# EAGLE design ConverterBoard (EAGLE 8.3.2)
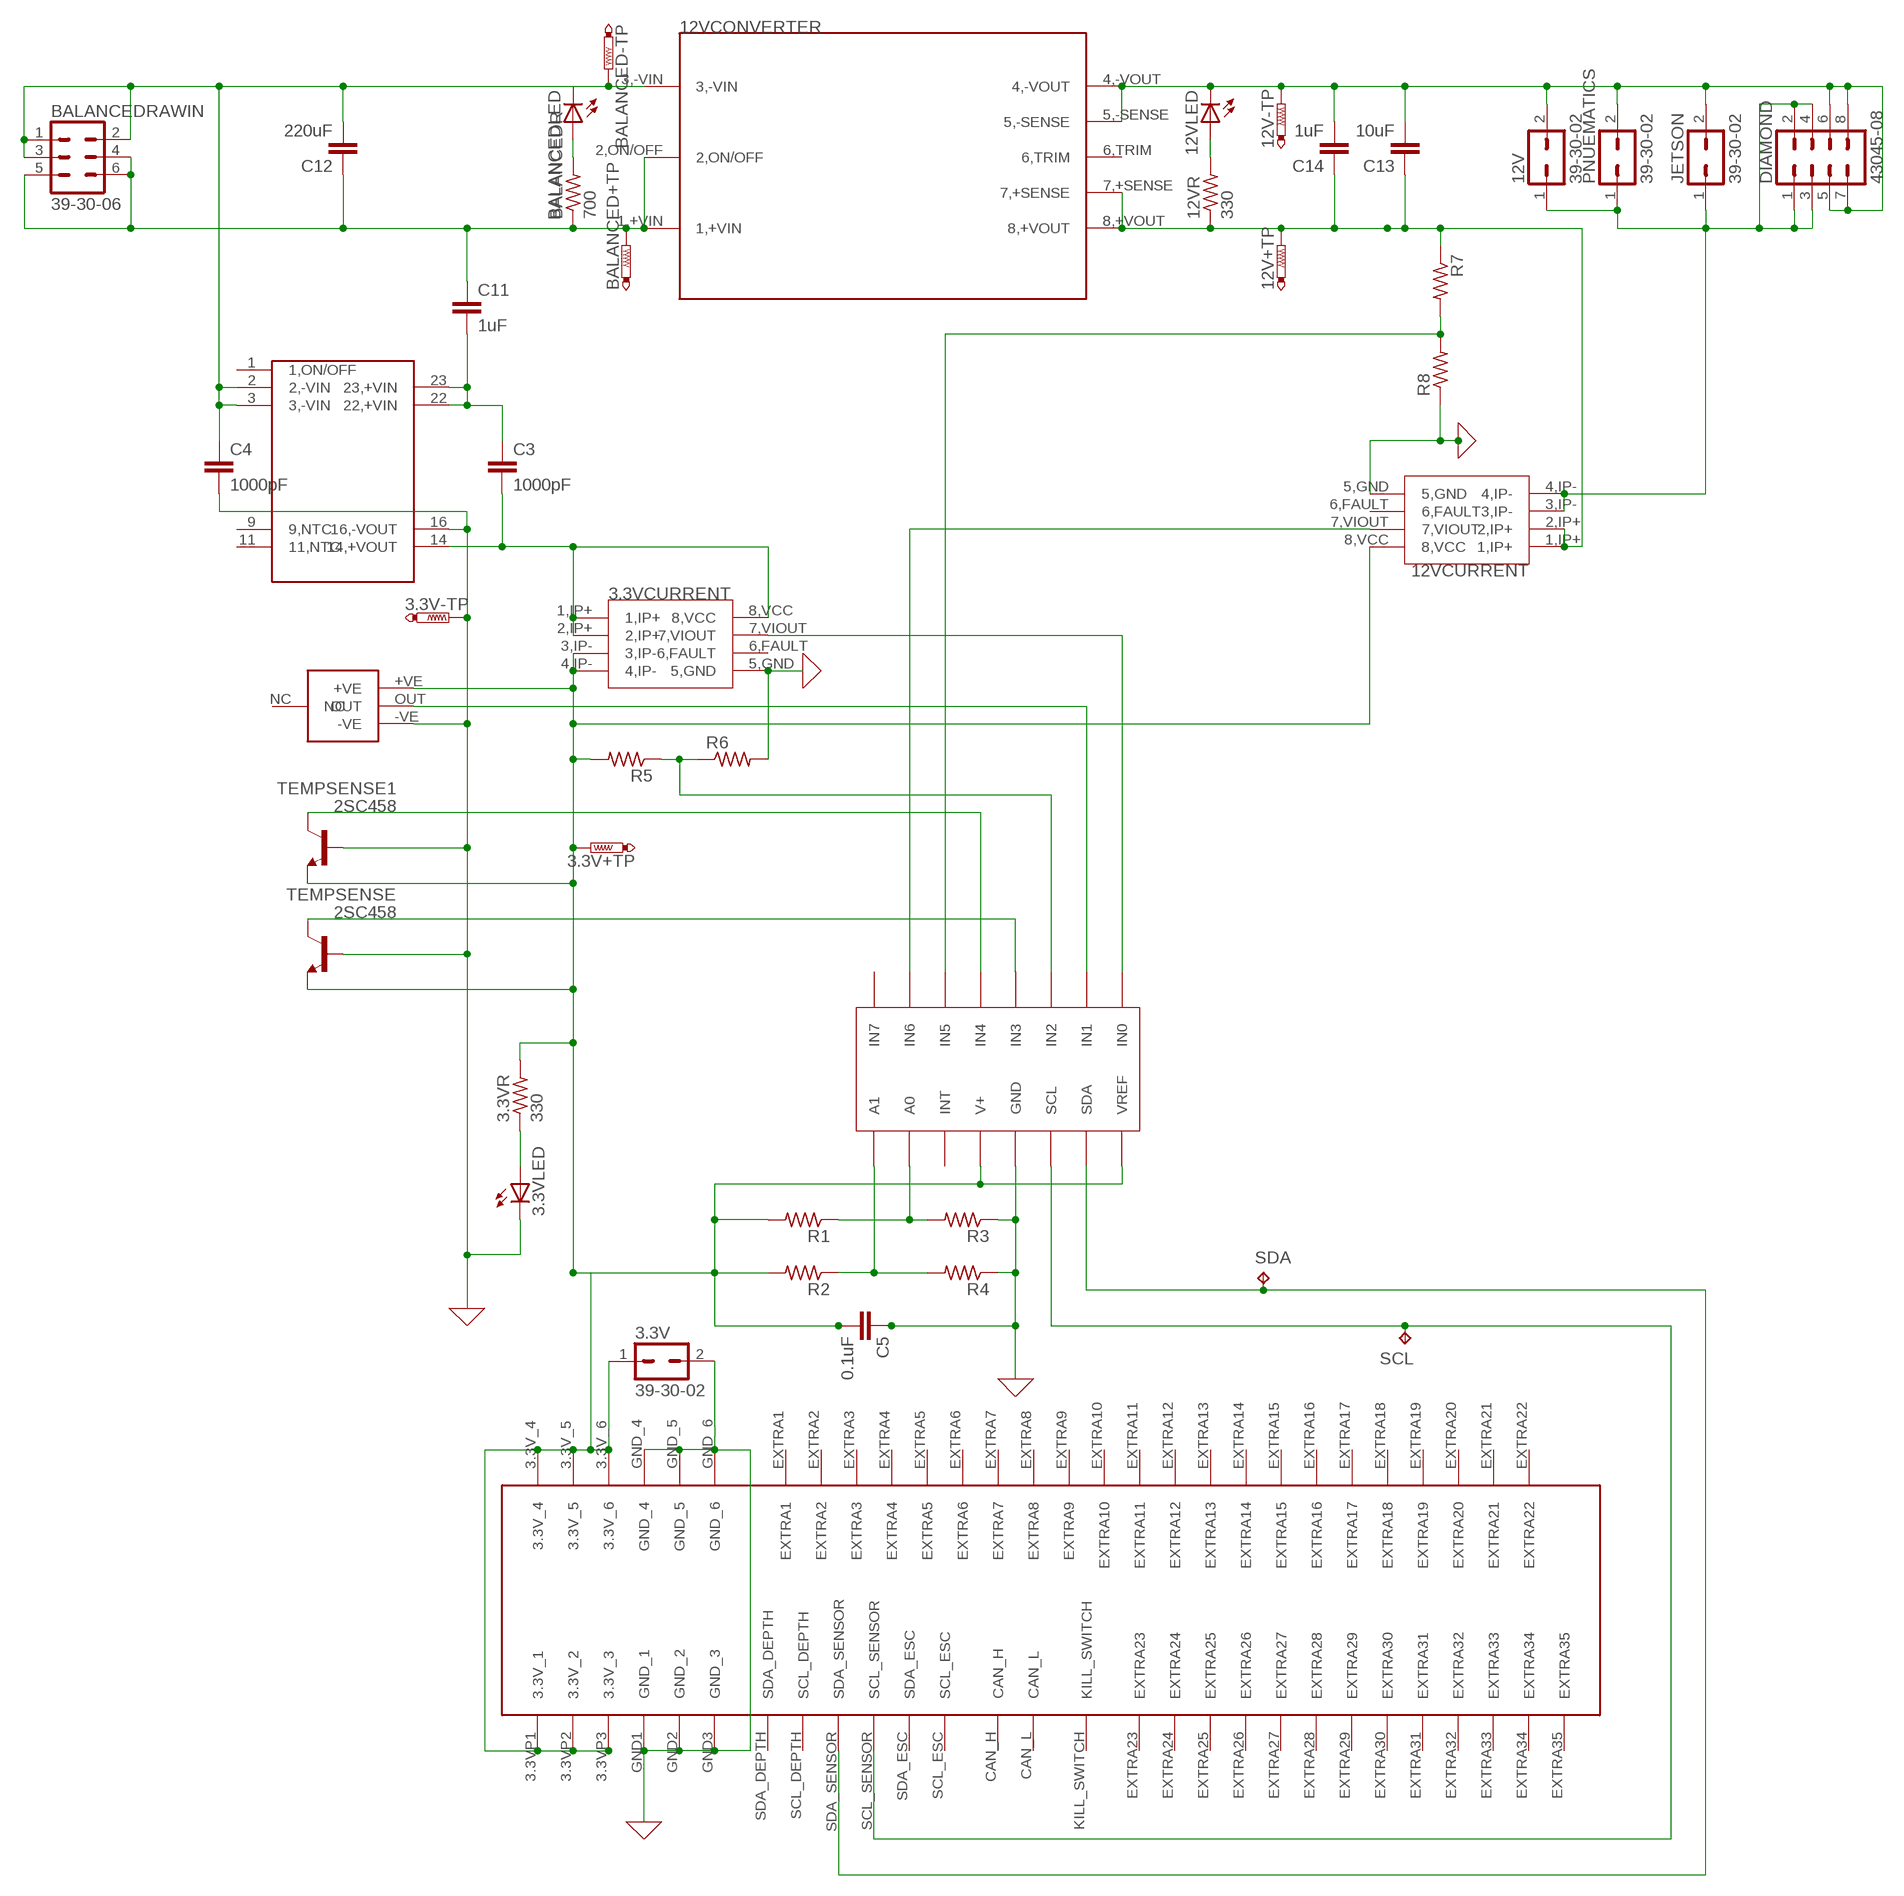
[diagram p0: schematic, sheet 1]

## Parts
3.3V  39-30-02  [39-30-?02?]
3.3V+TP  PTR1B1,27  [B1,27]
3.3V-TP  PTR1B1,27  [B1,27]
3.3VCURRENT  CURRENTSENS  [CURRENTSENS]
3.3VLED  LTST-S270GKT  [LTST-S270GKT]
3.3VR  330  R-US_0204/7  [0204/7]
12V  39-30-02  [39-30-?02?]
12V+TP  PTR1B1,27  [B1,27]
12V-TP  PTR1B1,27  [B1,27]
12VCONVERTER  12VCONV  [12VCONV]
12VCURRENT  CURRENTSENS  [CURRENTSENS]
12VLED  LTST-S270GKT  [LTST-S270GKT]
12VR  330  R-US_0204/7  [0204/7]
ADC  ADC128D818  [TSSOP-16]
BALANCED+TP  PTR1B1,27  [B1,27]
BALANCED-TP  PTR1B1,27  [B1,27]
BALANCEDLED  LTST-S270GKT  [LTST-S270GKT]
BALANCEDR  700  R-US_0204/7  [0204/7]
BALANCEDRAWIN  39-30-06  [39-30-?06?]
C3  1000pF  C5/3  [C5B3]
C4  1000pF  C5/3  [C5B3]
C5  0.1uF  C2.5/2  [C2.5-2]
C11  1uF  C5/3  [C5B3]
C12  220uF  C5/3  [C5B3]
C13  10uF  C5/3  [C5B3]
C14  1uF  C5/3  [C5B3]
DIAMOND  43045-08  [43045-08]
JETSON  39-30-02  [39-30-?02?]
PNUEMATICS  39-30-02  [39-30-?02?]
R1  R-US_0204/7  [0204/7]
R2  R-US_0204/7  [0204/7]
R3  R-US_0204/7  [0204/7]
R4  R-US_0204/7  [0204/7]
R5  R-US_0204/7  [0204/7]
R6  R-US_0204/7  [0204/7]
R7  R-US_0204/7  [0204/7]
R8  R-US_0204/7  [0204/7]
SCL  TPPAD1-20  [P1-20]
SDA  TPPAD1-20  [P1-20]
TEMPSENSE  2SC458  [TO92-ECB]
TEMPSENSE1  2SC458  [TO92-ECB]
U$2  3.3VCONV  [3.3VCONV]
U$3  5530843  [5530843-6-BOARDFINGERS]
U$6  HUMIDITYSENSOR  [HUMIDITYSENSOR]

## Nets
3.3VCONVIN: C3.1 C11.2 U$2.22(22,+VIN) U$2.23(23,+VIN)
3.3VCONVOUT: 3.3VCURRENT.1,IP+ 3.3VCURRENT.2,IP+ 3.3VCURRENT.8,VCC C3.2 U$2.14(14,+VOUT)
3.3VCURRENTDATA: 3.3VCURRENT.7,VIOUT ADC.IN0
3.3VCURRENTOUT: 3.3V+TP.TP 3.3V.1 3.3VCURRENT.3,IP- 3.3VCURRENT.4,IP- 3.3VR.2 12VCURRENT.8,VCC ADC.V+ ADC.VREF C5.2 R1.2 R2.2 R5.2 TEMPSENSE1.E TEMPSENSE.E U$3.3.3V_4 U$3.3.3V_5 U$3.3.3V_6 U$3.3.3VP1(3.3V_1) U$3.3.3VP2(3.3V_2) U$3.3.3VP3(3.3V_3) U$6.+VE
3.3VDATA: ADC.IN2 R5.1 R6.1
3.3VLED: 3.3VLED.ANODE(A) 3.3VR.1
12VCONV+: 12V+TP.TP 12VCONVERTER.7,+SENSE 12VCONVERTER.8,+VOUT 12VCURRENT.1,IP+ 12VCURRENT.2,IP+ 12VR.1 C13.1 C14.1 R7.1
12VCURRENTDATA: 12VCURRENT.7,VIOUT ADC.IN6
12VCURRENTOUT: 12V.1 12VCURRENT.3,IP- 12VCURRENT.4,IP- DIAMOND.1 DIAMOND.2 DIAMOND.3 DIAMOND.4 JETSON.1 PNUEMATICS.1
12VDIV: ADC.IN5 R7.2 R8.2
12VLED: 12VLED.ANODE(A) 12VR.2
A0: ADC.A0 R1.1 R3.2
A1: ADC.A1 R2.1 R4.2
BALANCED+: 12VCONVERTER.1,+VIN 12VCONVERTER.2,ON/OFF BALANCED+TP.TP BALANCEDR.1 BALANCEDRAWIN.4 BALANCEDRAWIN.5 BALANCEDRAWIN.6 C11.1 C12.1
BALANCEDGND: 12VCONVERTER.3,-VIN BALANCED-TP.TP BALANCEDLED.CATHODE(C) BALANCEDRAWIN.1 BALANCEDRAWIN.2 BALANCEDRAWIN.3 C4.1 C12.2 U$2.2(2,-VIN) U$2.3(3,-VIN)
BALANCEDLED: BALANCEDLED.ANODE(A) BALANCEDR.2
CMGND: 3.3V-TP.TP 3.3V.2 3.3VCURRENT.5,GND 3.3VLED.CATHODE(C) 12V-TP.TP 12V.2 12VCONVERTER.4,-VOUT 12VCONVERTER.5,-SENSE 12VCURRENT.5,GND 12VLED.CATHODE(C) ADC.GND C4.2 C5.1 C13.2 C14.2 DIAMOND.5 DIAMOND.6 DIAMOND.7 DIAMOND.8 JETSON.2 PNUEMATICS.2 R3.1 R4.1 R6.2 R8.1 TEMPSENSE1.B TEMPSENSE.B U$2.16(16,-VOUT) U$3.GND1(GND_1) U$3.GND2(GND_2) U$3.GND3(GND_3) U$3.GND_4 U$3.GND_5 U$3.GND_6 U$6.-VE ; supply symbol labelled GND
HUMIDITYDATA: ADC.IN1 U$6.OUT
SCL: ADC.SCL SCL.TP U$3.SCL_SENSOR
SDA: ADC.SDA SDA.TP U$3.SDA_SENSOR
TEMP1DATA: ADC.IN4 TEMPSENSE1.C
TEMPDATA: ADC.IN3 TEMPSENSE.C
Unconnected: 3.3VCURRENT.6,FAULT 12VCONVERTER.6,TRIM 12VCURRENT.6,FAULT ADC.IN7 ADC.INT U$2.1(1,ON/OFF) U$2.9(9,NTC) U$2.11(11,NTC) U$3.CAN_H U$3.CAN_L U$3.EXTRA1 U$3.EXTRA2 U$3.EXTRA3 U$3.EXTRA4 U$3.EXTRA5 U$3.EXTRA6 U$3.EXTRA7 U$3.EXTRA8 U$3.EXTRA9 U$3.EXTRA10 U$3.EXTRA11 U$3.EXTRA12 U$3.EXTRA13 U$3.EXTRA14 U$3.EXTRA15 U$3.EXTRA16 U$3.EXTRA17 U$3.EXTRA18 U$3.EXTRA19 U$3.EXTRA20 U$3.EXTRA21 U$3.EXTRA22 U$3.EXTRA23 U$3.EXTRA24 U$3.EXTRA25 U$3.EXTRA26 U$3.EXTRA27 U$3.EXTRA28 U$3.EXTRA29 U$3.EXTRA30 U$3.EXTRA31 U$3.EXTRA32 U$3.EXTRA33 U$3.EXTRA34 U$3.EXTRA35 U$3.KILL_SWITCH U$3.SCL_DEPTH U$3.SCL_ESC U$3.SDA_DEPTH U$3.SDA_ESC U$6.NC

## Library data of the parts
3.3V 12V JETSON PNUEMATICS = con-molex-mini-fit:39-30-?02?: HEADER
3.3V+TP 3.3V-TP 12V+TP 12V-TP BALANCED+TP BALANCED-TP = testpad:PTR1: TEST PIN
3.3VCURRENT 12VCURRENT = CurrentSensor:CURRENTSENS
3.3VLED 12VLED BALANCEDLED = LTST-S270GKT:LTST-S270GKT
3.3VR 12VR BALANCEDR R1-R8 = resistor:R-US_: RESISTOR, American symbol
12VCONVERTER = 12VCONV:12VCONV
ADC = ADC128D818:ADC128D818
BALANCEDRAWIN = con-molex-mini-fit:39-30-?06?: HEADER
C3-C5 C11-C14 = capacitor-wima:C: CAPACITOR naming: grid - package width
DIAMOND = con-molex-micro-fit:43045-08: HEADER
SCL SDA = testpad:TP: Test pad
TEMPSENSE TEMPSENSE1 = transistor:2SC458: NPN Silicon Epitaxial Planar Transistor Source: SEMTECH ELECTRONICS LTD. ... 2SC458 1.pdf
U$2 = 3.3V Converter:3.3VCONV
U$3 = 5530843-6:5530843
U$6 = HumiditySensor:HUMIDITYSENSOR

## Board
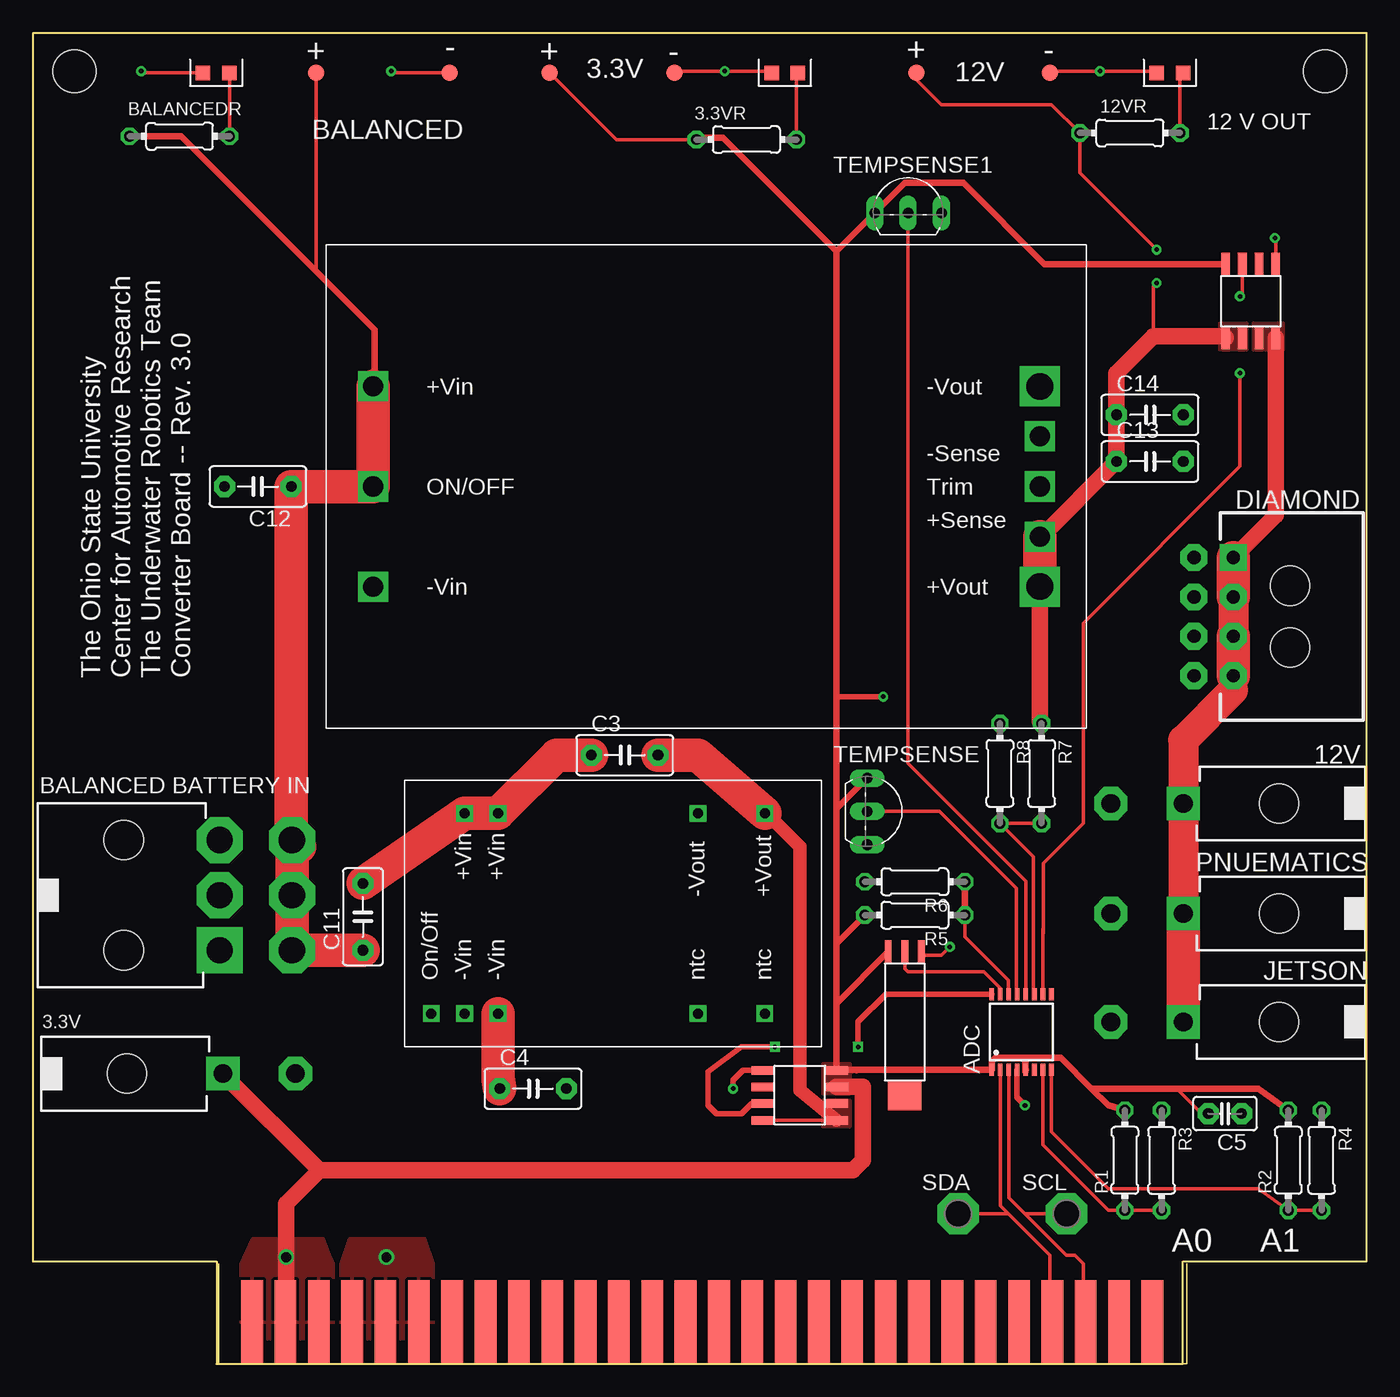
[diagram p1: board, top side]
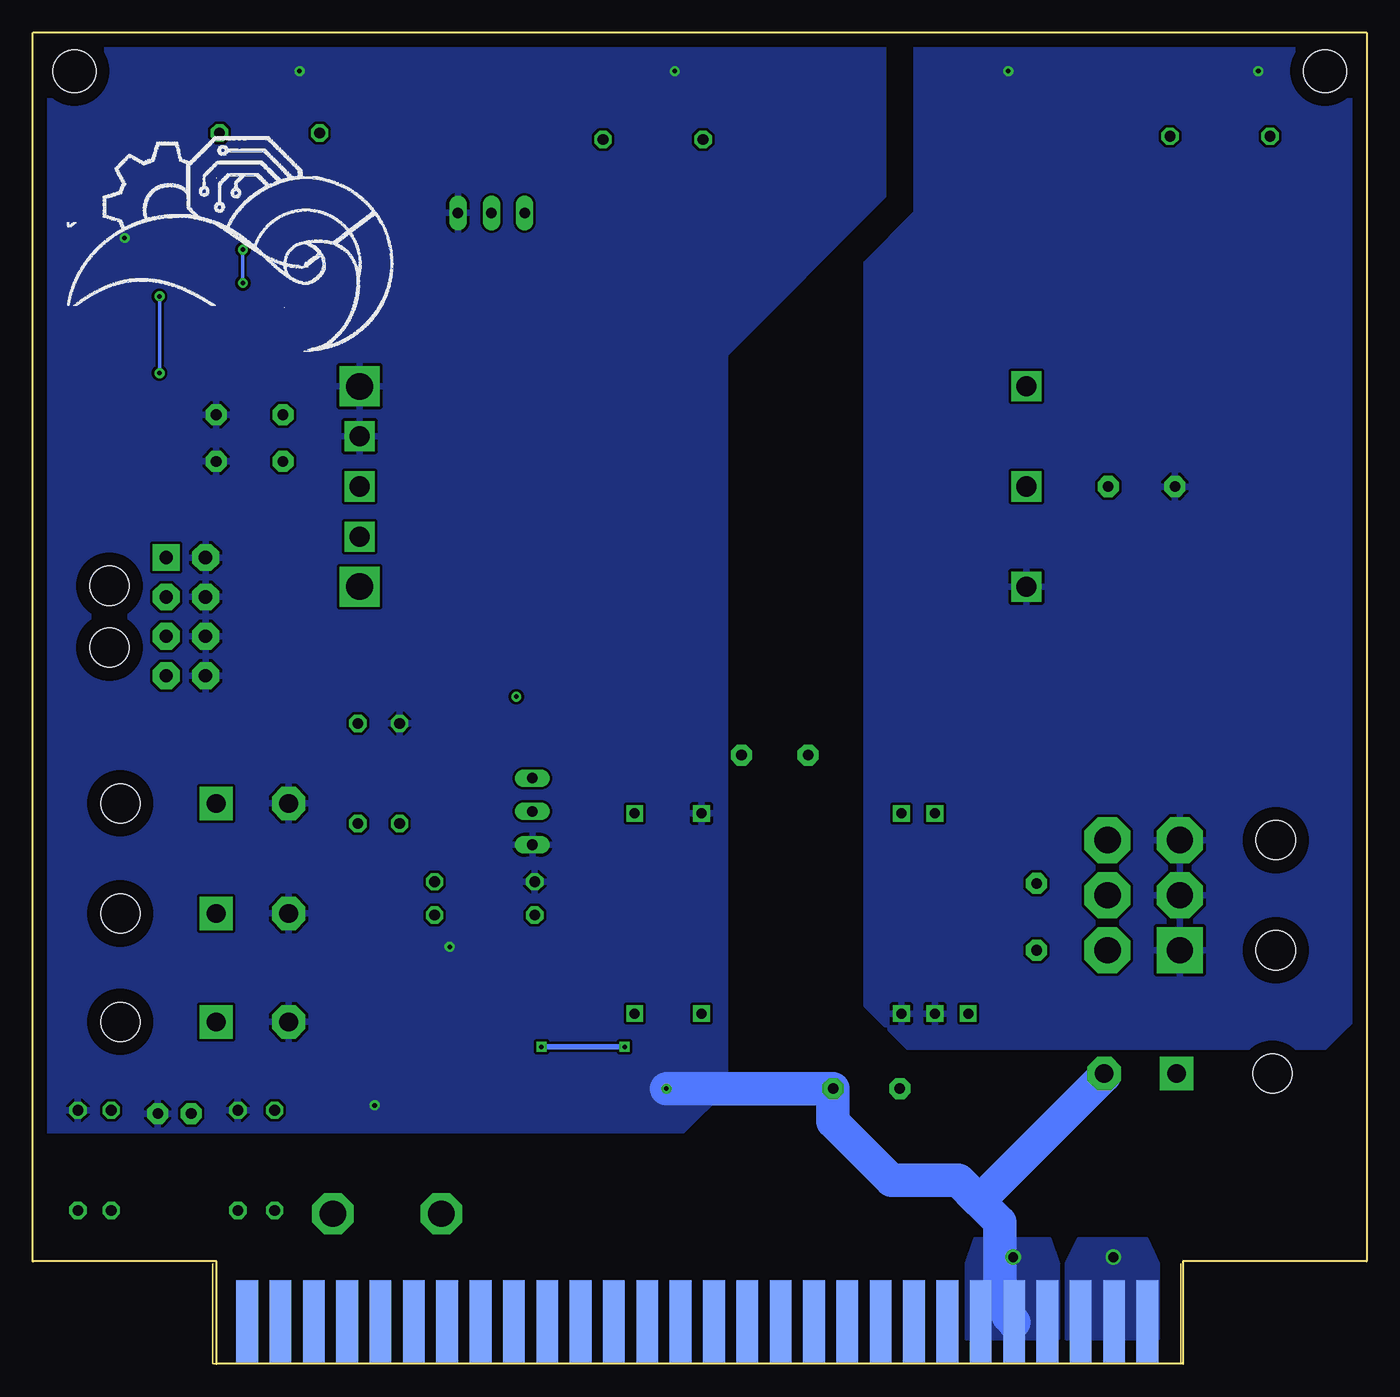
[diagram p2: board, bottom side, seen from below]

Size 101.6 x 101.35 mm. Coordinates in mm from the lower left corner, seen from the top.
Outline: 14,0 87.6,0 87.6,7.8 101.6,7.8 101.6,101.35 0,101.35 0,7.8 14,7.8 14,0
Copper layers (1*16): Top 0.035mm / dielectric 1.5mm / Bottom 0.035mm
Design rules "battery_balancer": minimum track width 6mil, minimum drill 0.35mm, track to track 0.205mm, track to pad 0.205mm, pad to pad 0.205mm, via to via 0.205mm, smd to smd 6mil, copper to edge 40mil, drill to drill 6mil, minimum pad ring 10mil, minimum via ring 8mil, stop-mask expansion 4mil, vias tented up to drill 0mil, thermal gap 10mil
Holes 3.26 mm at 3.17,98.42 98.42,98.42

### Footprints (pad centres in the part's own frame; a part is rotated, then mirrored left to right if it is on the bottom)
39-30-?02? = drill 1.422 pad 2.54 square: 1 0,0 | drill 1.422 pad 2.54 octagon: 2 0,5.512 | hole 3: 0,-7.3
B1,27 = smd 1.27 x 1.27: TP 0,0
CURRENTSENS = smd 0.65 x 1.75: 1,IP+ 0,0; 2,IP+ 1.27,0; 3,IP- 2.54,0; 4,IP- 3.81,0; 5,GND 3.81,5.6; 6,FAULT 2.54,5.6; 7,VIOUT 1.27,5.6; 8,VCC 0,5.6
LTST-S270GKT = smd 1.1 x 1.1: ANODE 1,0; CATHODE -1,0
0204/7 = drill 0.813 octagon: 1 -3.81,0; 2 3.81,0
12VCONV = drill 1.524 square: 1,+VIN 3.556,26.035; 2,ON/OFF 3.556,18.415; 3,-VIN 3.556,10.795; 5,-SENSE 54.356,22.225; 6,TRIM 54.356,18.415; 7,+SENSE 54.356,14.605 | drill 2.032 square: 4,-VOUT 54.356,26.035; 8,+VOUT 54.356,10.795
TSSOP-16 = smd 0.9 x 0.35: A0 -2.875,-1.625; A1 -2.875,-2.275; GND -2.875,0.325; IN0 2.875,2.275; IN1 2.875,1.625; IN2 2.875,0.975; IN3 2.875,0.325; IN4 2.875,-0.325; IN5 2.875,-0.975; IN6 2.875,-1.625; IN7 2.875,-2.275; INT -2.875,-0.975; SCL -2.875,0.975; SDA -2.875,1.625; V+ -2.875,-0.325; VREF -2.875,2.275
39-30-?06? = drill 2 pad 3.5 square: 1 4.191,0 | drill 2 pad 3.5 octagon: 2 0,0; 3 -4.191,0; 4 4.191,5.512; 5 0,5.512; 6 -4.191,5.512 | hole 3: -4.191,-7.3; 4.191,-7.3
C5B3 = drill 0.813 pad 1.6 octagon: 1 -2.54,0; 2 2.54,0
C2.5-2 = drill 0.813 pad 1.6 octagon: 1 -1.27,0; 2 1.27,0
43045-08 = drill 1.016 pad 2.032 square: 1 4.5,0 | drill 1.016 pad 2.032 octagon: 2 1.5,0; 3 -1.5,0; 4 -4.5,0; 5 4.5,3; 6 1.5,3; 7 -1.5,3; 8 -4.5,3 | hole 3: -2.35,-4.32; 2.35,-4.32
P1-20 = drill 2.007 pad 3.15 octagon: TP 0,0
TO92-ECB = drill 0.813 long: B 2.54,0; C 0,0; E -2.54,0
3.3VCONV = drill 0.762 square: 1 2.54,29.718; 2 2.54,27.178; 3 2.54,24.638; 9 2.54,9.398; 11 2.54,4.318; 14 17.78,4.318; 16 17.78,9.398; 22 17.78,24.638; 23 17.78,27.178
5530843-6-BOARDFINGERS = smd 1.651 x 6.35 bottom: 3.3V_4 0.826,3.175; 3.3V_5 3.365,3.175; 3.3V_6 5.905,3.175; EXTRA1 16.066,3.175; EXTRA2 18.605,3.175; EXTRA3 21.145,3.175; EXTRA4 23.686,3.175; EXTRA5 26.226,3.175; EXTRA6 28.765,3.175; EXTRA7 31.305,3.175; EXTRA8 33.846,3.175; EXTRA9 36.386,3.175; EXTRA10 38.925,3.175; EXTRA11 41.465,3.175; EXTRA12 44.005,3.175; EXTRA13 46.545,3.175; EXTRA14 49.086,3.175; EXTRA15 51.626,3.175; EXTRA16 54.166,3.175; EXTRA17 56.706,3.175; EXTRA18 59.245,3.175; EXTRA19 61.785,3.175; EXTRA20 64.326,3.175; EXTRA21 66.865,3.175; EXTRA22 69.406,3.175; GND_4 8.445,3.175; GND_5 10.986,3.175; GND_6 13.525,3.175 | smd 1.651 x 6.35: 3.3VP1 0.826,3.175; 3.3VP2 3.365,3.175; 3.3VP3 5.905,3.175; CAN_H 51.626,3.175; CAN_L 54.166,3.175; EXTRA23 16.066,3.175; EXTRA24 18.605,3.175; EXTRA25 21.145,3.175; EXTRA26 23.686,3.175; EXTRA27 26.226,3.175; EXTRA28 28.765,3.175; EXTRA29 31.305,3.175; EXTRA30 33.846,3.175; EXTRA31 36.386,3.175; EXTRA32 38.925,3.175; EXTRA33 41.465,3.175; EXTRA34 44.005,3.175; EXTRA35 46.545,3.175; GND1 8.445,3.175; GND2 10.986,3.175; GND3 13.525,3.175; KILL_SWITCH 49.086,3.175; SCL_DEPTH 59.245,3.175; SCL_ESC 69.406,3.175; SCL_SENSOR 64.326,3.175; SDA_DEPTH 56.706,3.175; SDA_ESC 66.865,3.175; SDA_SENSOR 61.785,3.175
HUMIDITYSENSOR = smd 0.51 x 1.78: +VE 2.54,0; -VE 0,0; OUT 1.27,0 | smd 2.54 x 2.29: NC 1.27,10.925

### Placement (x,y rotation side)
3.3V  39-30-02?  [39-30-?02?]  14.48,22.1 270 top
3.3V+TP  39.37,98.3 0 top
3.3V-TP  48.9,98.3 0 top
3.3VCURRENT  61.21,18.54 90 top
3.3VLED  57.28,98.3 0 top
3.3VR  54.36,93.22 180 top
12V  39-30-02?  [39-30-?02?]  87.63,42.67 90 top
12V+TP  67.31,98.3 0 top
12V-TP  77.47,98.3 0 top
12VCONVERTER  22.35,48.39 0 top
12VCURRENT  90.86,78.13 0 top
12VLED  86.61,98.3 0 top
12VR  83.57,93.73 0 top
ADC  75.31,25.27 90 top
BALANCED+TP  21.59,98.3 0 top
BALANCED-TP  31.75,98.3 0 top
BALANCEDLED  13.97,98.3 0 top
BALANCEDR  11.18,93.47 0 top
BALANCEDRAWIN  39-30-06?  [39-30-?06?]  14.22,35.69 270 top
C3  45.09,46.35 0 top
C4  38.1,20.95 0 top
C5  90.81,19.05 180 top
C11  25.15,34.04 90 top
C12  17.14,66.8 180 top
C13  85.09,68.71 0 top
C14  85.09,72.26 0 top
DIAMOND  91.44,56.9 90 top
JETSON  39-30-02?  [39-30-?02?]  87.63,26.04 90 top
PNUEMATICS  39-30-02?  [39-30-?02?]  87.63,34.29 90 top
R1  83.19,15.49 90 top
R2  95.63,15.49 90 top
R3  85.98,15.49 270 top
R4  98.17,15.49 270 top
R5  67.18,34.16 180 top
R6  67.18,36.7 180 top
R7  76.83,44.96 270 top
R8  73.66,44.96 270 top
SCL  78.74,11.43 0 top
SDA  70.48,11.43 0 top
TEMPSENSE  63.55,42.06 270 top
TEMPSENSE1  66.67,87.63 0 top
U$2  60.07,24.13 90 top
U$3  15.88,0 0 top
U$6  67.69,31.37 180 top

### Tracks (layer width: path | path; a pad name or v marks a point on that pad's centre or on a via)
3.3VCONVIN
  Top 2.54: C11.2 29.59,39.62 U$2.23 U$2.22 39.88,46.35 C3.1
3.3VCONVOUT
  Top 0.254: 3.3VCURRENT.8,VCC 3.3VCURRENT.1,IP+
  Top 0.762: U$2.14 55.88,41.91
  Top 1.016: 3.3VCURRENT.1,IP+ 58.42,20.83 58.42,39.37 55.88,41.91
  Top 2.54: U$2.14 50.67,46.35 C3.2
  pour Top: 60.33,20.32 60.33,18.41 62.23,18.41 62.23,20.32
  pour Top (no thermals): 60.2,20.07 62.23,20.07 62.23,18.03 60.2,18.03
3.3VCURRENTDATA  (via drill 0.35)
  Top 0.406: ADC.IN0 64.98,28.15 62.87,26.04 v62.87,24.13 | v56.52,24.13 53.98,24.13 51.44,22.23 51.44,19.68 52.07,19.05 53.98,19.05 54.74,19.81 3.3VCURRENT.7,VIOUT
  Bottom 0.406: v56.52,24.13 v62.87,24.13
3.3VCURRENTOUT  (via drill 0.35, 0.75)
  Top 0.254: 3.3VR.2 44.45,93.22 3.3V+TP.TP | C5.2 89.03,19.05 87.12,20.95
  Top 0.406: 61.26,22.4 3.3VCURRENT.4,IP- | v64.77,50.8 61.21,50.8
  Top 0.508: 3.3VCURRENT.4,IP- 61.21,27.43 | 61.21,27.43 U$6.+VE | 61.21,27.43 61.21,32 | 61.21,32 61.21,42.27 | 61.21,42.27 TEMPSENSE.E | 61.21,42.27 61.21,50.8 61.21,84.71 | 63.94,87.44 TEMPSENSE1.E | 63.94,87.44 61.21,84.71 | 61.21,84.71 52.58,93.34 51.44,93.34 | 51.44,93.34 50.8,93.34 | R5.2 61.21,32 | 75.35,23.31 75.62,23.04 75.62,22.41 ADC.V+ 75.62,22.38 75.62,22.23 | 75.35,23.31 73.32,23.31 73.05,23.04 73.05,22.41 ADC.VREF 62.78,22.4 | 62.78,22.4 62.74,22.35 | R2.2 93.34,20.95 87.12,20.95 80.64,20.95 | 80.64,20.95 78.29,23.31 75.35,23.31 | R1.2 81.92,19.68 80.64,20.95 | 62.78,22.4 61.26,22.4 | 3.3VR.2 51.31,93.22 51.44,93.34 | 12VCURRENT.8,VCC 77.05,83.73 70.87,89.92 66.42,89.92 63.94,87.44
  Top 0.762: 19.3,3.24 U$3.3.3V_5
  Top 1.27: 3.3VCURRENT.3,IP- 63.25,21.08 63.25,15.49 62.48,14.73 21.84,14.73 | 21.84,14.73 19.3,12.19 v19.3,8.13 19.3,3.24 | 3.3V.1 21.84,14.73
  pour Top: 60.33,22.86 60.33,20.95 62.23,20.95 62.23,22.86
  pour Top: 15.88,7.62 15.88,1.91 22.86,1.91 22.86,7.62 22.48,8.51 22.1,9.53 16.76,9.53
  pour Bottom (no thermals): 15.88,7.62 15.88,1.91 22.86,1.91 22.86,7.62 21.97,9.53 16.76,9.53
  pour Top: 60.33,22.86 62.23,22.86 62.23,20.95 60.33,20.95
  pour Top: 60.33,22.86 62.23,22.86 62.23,20.95 60.33,20.95
  pour Top (no thermals): 60.2,22.86 62.23,22.86 62.23,20.57 60.2,20.57
3.3VDATA
  Top 0.254: ADC.IN2 74.3,28.19 74.3,29.21 70.99,32.51 R5.1
  Top 0.508: R5.1 R6.1
3.3VLED
  Top 0.254: 3.3VR.1 58.17,98.19 3.3VLED.ANODE
12VCONV+  (via drill 0.35)
  Top 0.254: 12V+TP.TP 67.31,97.79 69.22,95.89 77.6,95.89 12VR.1 79.76,90.68 v85.6,84.84 | 85.34,78.23 85.34,82.04 v85.6,82.3
  Top 1.27: 76.96,62.99 12VCONVERTER.7,+SENSE 76.83,62.99 C13.1 C14.1 82.55,75.44 85.34,78.23 90.75,78.23 12VCURRENT.1,IP+ | 12VCONVERTER.8,+VOUT 76.71,48.9 R7.1
  Top 2.54: 12VCONVERTER.8,+VOUT 12VCONVERTER.7,+SENSE
  Bottom 0.254: v85.6,84.84 v85.6,82.3
  pour Top (no thermals): 92.46,79.25 92.46,77.22 90.42,77.22 90.42,78.99 90.42,79.25
12VCURRENTDATA  (via drill 0.35)
  Top 0.254: 76.94,32.77 ADC.IN6 | 76.94,32.77 76.94,33.12 | 12VCURRENT.7,VIOUT 92.13,81.46 v91.95,81.28 | 76.94,32.77 76.96,32.79 76.96,38.1 80.01,41.15 80.01,56.39 91.95,68.33 v91.95,75.44
  Bottom 0.254: v91.95,81.28 v91.95,75.44
12VCURRENTOUT
  Top 0.254: 91.44,51.31 DIAMOND.4
  Top 1.27: 12VCURRENT.4,IP- 94.67,64.62 DIAMOND.1
  Top 2.286: DIAMOND.1 DIAMOND.4 | 91.44,51.31 87.63,47.5 12V.1 PNUEMATICS.1
  Top 2.54: DIAMOND.1 DIAMOND.2 | DIAMOND.4 DIAMOND.3 | PNUEMATICS.1 JETSON.1
  pour Top (no thermals): 92.96,79.25 95.25,79.25 95.25,77.22 92.96,77.22
12VDIV
  Top 0.254: R7.2 R8.2 76.2,38.61 76.2,28.23 ADC.IN5
12VLED
  Top 0.254: 12VR.2 87.38,98.06 12VLED.ANODE
A0
  Top 0.254: R3.2 R1.1 81.92,11.68 76.94,16.66 ADC.A0
A1
  Top 0.254: R4.2 R2.1 93.34,13.34 81.92,13.34 77.59,17.66 ADC.A1
BALANCED+
  Top 0.254: BALANCED+TP.TP 21.59,83.19
  Top 0.508: BALANCEDR.1 11.3,93.47 21.59,83.19 26.04,78.74 26.04,74.55 12VCONVERTER.1,+VIN
  Top 2.54: BALANCEDRAWIN.6 BALANCEDRAWIN.4 21.97,31.5 C11.1 | BALANCEDRAWIN.6 19.86,40.01 | BALANCEDRAWIN.5 BALANCEDRAWIN.6 | 19.68,39.93 BALANCEDRAWIN.6 | 12VCONVERTER.1,+VIN 12VCONVERTER.2,ON/OFF C12.1 19.68,40.01 20.32,39.37 20.24,39.37 BALANCEDRAWIN.6
BALANCEDGND  (via drill 0.35)
  Top 0.254: v27.3,98.42 27.43,98.3 BALANCED-TP.TP | v8.26,98.42 8.38,98.3 BALANCEDLED.CATHODE
  Top 2.54: U$2.3 35.43,21.72 C4.1
  pour Bottom: 0,101.6 0,27.3 3.17,24.13 34.92,24.13 38.1,27.3 38.1,83.82 34.29,87.63 34.29,101.6
BALANCEDLED
  Top 0.254: BALANCEDLED.ANODE 14.99,98.28 BALANCEDR.2
CMGND  (via drill 0.35, 0.75)
  Top 0.254: 12VLED.CATHODE 85.49,98.42 v81.28,98.42 77.6,98.42 12V-TP.TP | 3.3V-TP.TP 49.02,98.42 v52.7,98.42 56.15,98.42 3.3VLED.CATHODE | v69.85,31.75 69.22,31.11 67.94,31.11 U$6.-VE | 55.49,22.23 3.3VCURRENT.5,GND | ADC.GND 74.96,22.4 | 12VCURRENT.5,GND 94.67,85.67 v94.61,85.72
  Top 0.406: v75.56,19.68 74.96,20.29 74.96,22.4 | v53.34,20.95 53.34,21.59 54.1,22.35 3.3VCURRENT.5,GND
  Bottom 2.54: v53.34,20.95 C4.2 40.64,18.41 36.2,13.97 31.11,13.97 29.53,12.38 | 29.53,12.38 27.94,10.79 27.94,4.45 27.3,3.81 27.3,3.62 U$3.GND_5 | 3.3V.2 19.99,21.92 29.53,12.38
  other vias: 26.92,8.13
  pour Bottom: 36.83,101.6 36.83,88.9 48.9,76.83 48.9,20.95 52.07,17.78 101.6,17.78 101.6,101.6
  pour Top: 23.5,7.62 23.5,1.91 30.48,1.91 30.48,7.62 29.84,9.53 24.13,9.53
  pour Bottom (no thermals): 23.5,7.62 23.5,1.91 30.48,1.91 30.48,7.62 29.84,9.53 24.13,9.53
HUMIDITYDATA
  Top 0.254: U$6.OUT 66.42,30.1 66.67,29.84 72.43,29.84 73.69,28.59 ADC.IN1
SCL
  Top 0.254: U$3.SCL_SENSOR 80.01,3.37 80.01,7.62 79.38,8.26 78.74,8.26 75.56,11.43 | ADC.SCL 74.34,12.66 75.56,11.43 | 75.56,11.43 SCL.TP
SDA
  Top 0.152: 77.5,3.84 77.47,3.81
  Top 0.254: ADC.SDA 73.69,12.04 74.3,11.43 | 74.3,11.43 77.47,8.26 77.47,2.54 77.5,2.57 77.5,3.01 | 77.5,3.01 77.5,3.84 | U$3.SDA_SENSOR 77.5,3.01 | SDA.TP 74.3,11.43
TEMP1DATA
  Top 0.254: ADC.IN4 75.64,36.76 66.67,45.72 TEMPSENSE1.C
TEMPDATA
  Top 0.254: ADC.IN3 74.93,28.2 74.93,36.2 69.06,42.06 TEMPSENSE.C

### Text on the board
tPlace: + | - | + | - | + | - | 3.3V | 12V | 12 V OUT | BALANCED | BALANCED BATTERY IN
tNames: The Ohio State University / Center for Automotive Research / The Underwater Robotics Team / Converter Board -- Rev. 3.0 | A0 | A1